# EAGLE design openSX70-dongle_v3-9 (EAGLE 9.2.2)
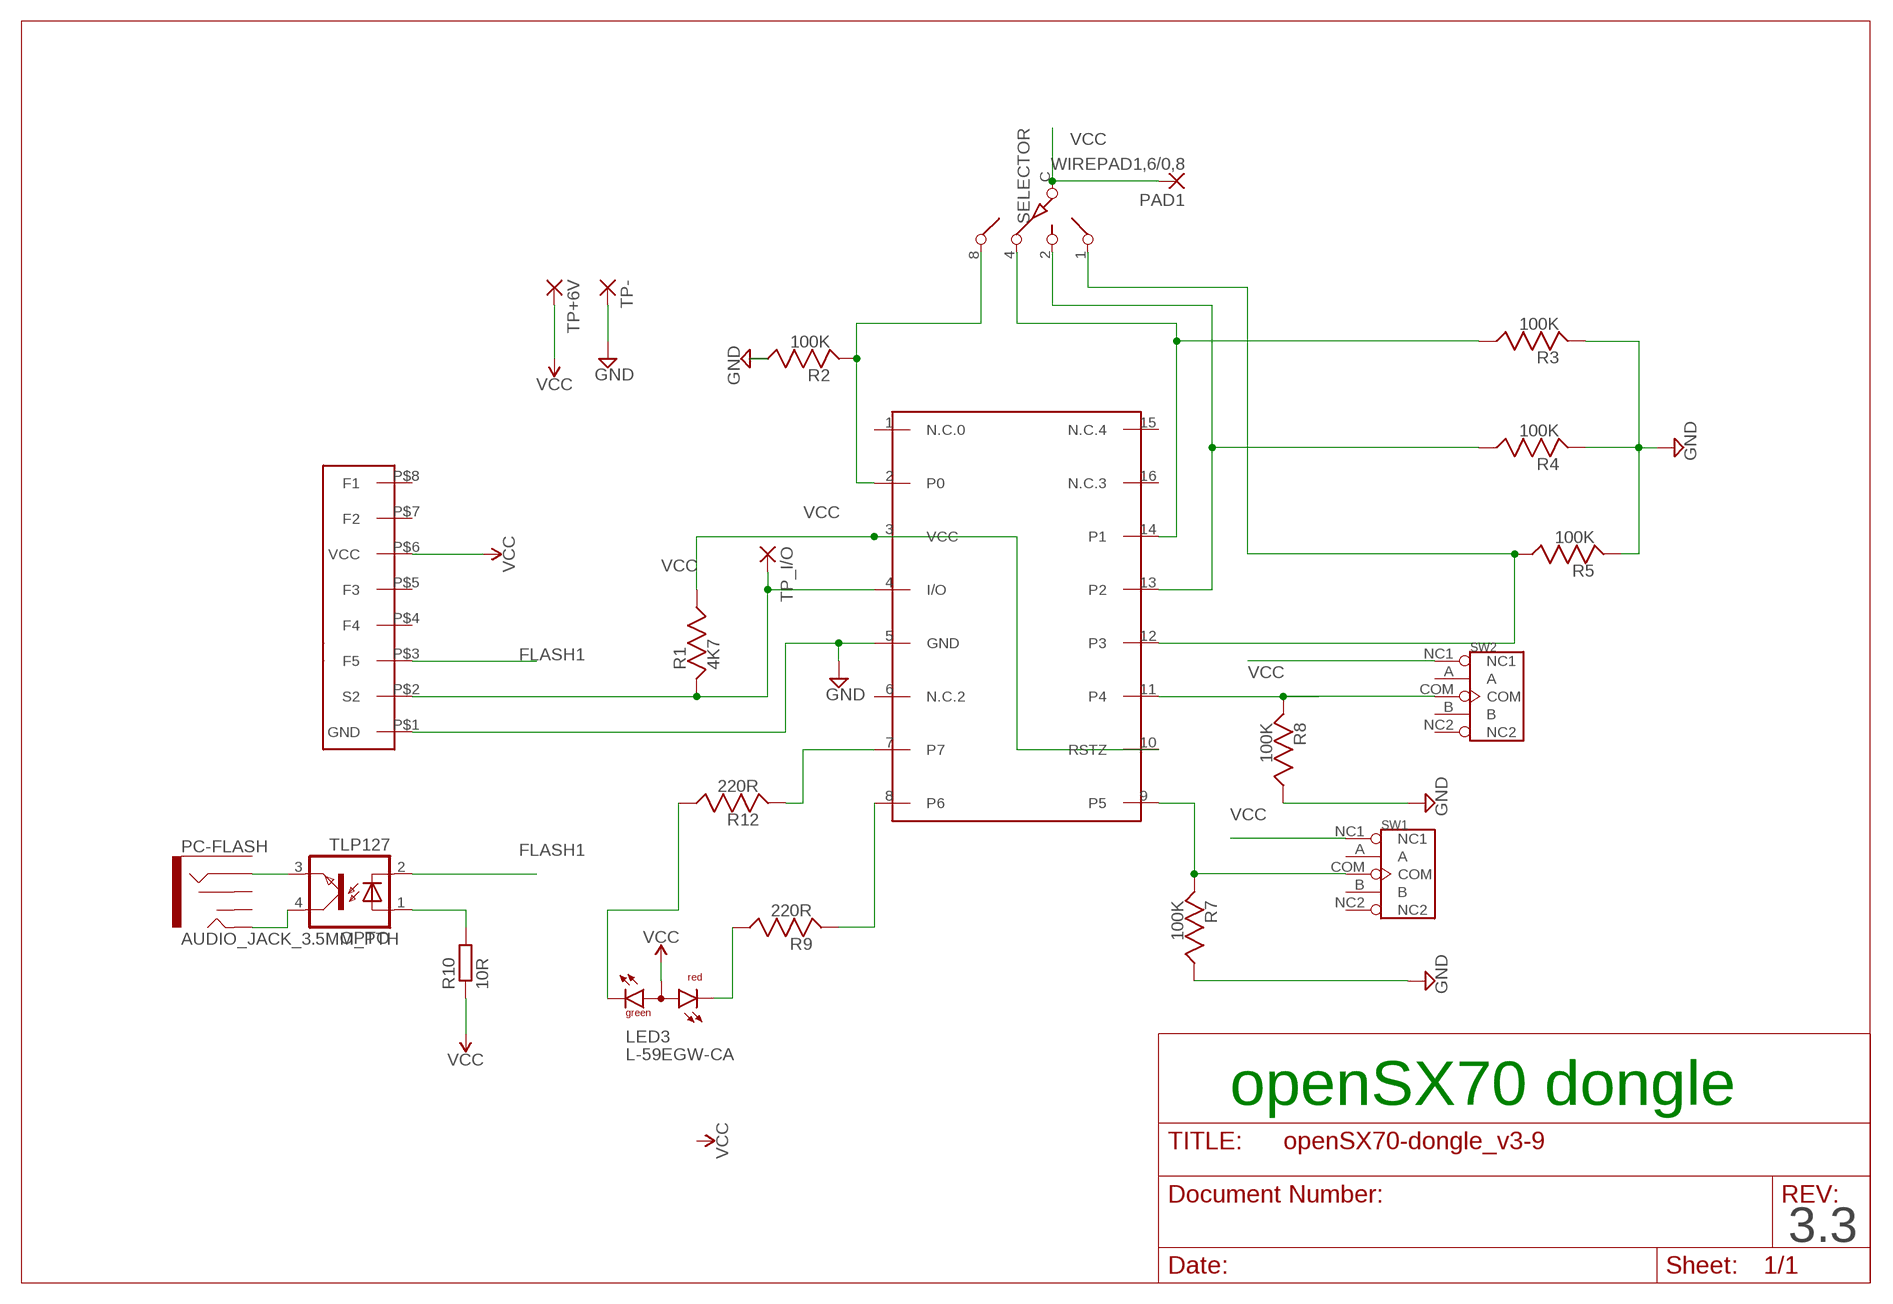
[diagram p0: schematic, sheet 1]

## Parts
DS2408  DS2408  [SO16]
LED3  L-59EGW-CA  [L-59EGW-CA]
OPTO  TLP127  [SO-4]
PAD1  WIREPAD1,6/0,8  [1,6/0,8]
PC-FLASH  AUDIO_JACK_3.5MM_PTH  [AUDIO-JACK]
R1  4K7  CRCW06034K70FKEA  [CRCW06034K70FKEA_RESC1608X55]
R2  100K  ERJ-3EKF1003V  [ERJ-3EKF1003V_RESC1608X55]
R3  100K  ERJ-3EKF1003V  [ERJ-3EKF1003V_RESC1608X55]
R4  100K  ERJ-3EKF1003V  [ERJ-3EKF1003V_RESC1608X55]
R5  100K  ERJ-3EKF1003V  [ERJ-3EKF1003V_RESC1608X55]
R7  100K  ERJ-3EKF1003V  [ERJ-3EKF1003V_RESC1608X55]
R8  100K  ERJ-3EKF1003V  [ERJ-3EKF1003V_RESC1608X55]
R9  220R  RC0603FR-07220RL  [RC0603FR-07220RL_RESC1608X55]
R10  10R  R-EU_R0603  [R0603]
R12  220R  RC0603FR-07220RL  [RC0603FR-07220RL_RESC1608X55]
SELECTOR  SW-C16  [SW-C16]
SW1  DIP-TOGGLE-SWITCH-ON-ON(3+2P-8.8X4.6MM)-90D  [SW5-2.0-8.8X4.4X4.7MM-90D]
SW2  DIP-TOGGLE-SWITCH-ON-ON(3+2P-8.8X4.6MM)-90D  [SW5-2.0-8.8X4.4X4.7MM-90D]
TP+6V  SMD2  [SMD1,27-2,54]
TP-  SMD2  [SMD1,27-2,54]
TP_I/O  SMD2  [SMD1,27-2,54]
U$1  FLASH-EDGE-CONNECTOR  [FLASH-EDGE-8]

## Nets
FLASH1: OPTO.2(C) U$1.P$3(F5)
GND: DS2408.5(GND) R2.2 R3.1 R4.1 R5.1 R7.2 R8.2 TP-.1(P) U$1.P$1(GND)
N$1: DS2408.4(I/O) R1.1 TP_I/O.1(P) U$1.P$2(S2)
N$2: LED3.1(CR) R9.2
N$3: DS2408.2(P0) R2.1 SELECTOR.8
N$4: DS2408.14(P1) R3.2 SELECTOR.4
N$5: DS2408.13(P2) R4.2 SELECTOR.2
N$6: DS2408.11(P4) R8.1 SW2.COM
N$7: DS2408.9(P5) R7.1 SW1.COM
N$8: DS2408.8(P6) R9.1
N$9: OPTO.1(A) R10.2
N$10: LED3.3(CG) R12.2
N$11: DS2408.7 R12.1
N$12: OPTO.4(COL) PC-FLASH.TIP
N$13: DS2408.12(P3) R5.2 SELECTOR.1
N$15: OPTO.3(EMIT) PC-FLASH.RING
VCC: DS2408.3(VCC) DS2408.10(RSTZ) LED3.2(A) PAD1.1(P) R1.2 R10.1 SELECTOR.C SW1.NC1 SW2.NC1 TP+6V.1(P) U$1.P$6(VCC)
Unconnected: DS2408.1(N.C.0) DS2408.6(N.C.2) DS2408.15(N.C.4) DS2408.16(N.C.3) PC-FLASH.RSH PC-FLASH.SLEEVE PC-FLASH.TSH SW1.A SW1.B SW1.NC2 SW2.A SW2.B SW2.NC2 U$1.P$4(F4) U$1.P$5(F3) U$1.P$7(F2) U$1.P$8(F1)

## Notes on the sheet
- openSX70 dongle
- 3.3

## Library data of the parts
DS2408 = DS2408-joaco:DS2408
LED3 = led:L-59EGW-CA: T-1 3/4 (5mm) BI-COLOR INDICATOR LAMP Source: http://www.kingbright.com/manager/upload/pdf/L-59EGW-CA%28Ver1292805989.13%29
OPTO = openSX70:TLP127
PAD1 = wirepad:WIREPAD: Wire PAD connect wire on PCB
PC-FLASH = SparkFun-Connectors:AUDIO_JACK_3.5MM: Audio Jack 3.5mm variants of PTH and SMT stereo audio jack with bypass switches. SparkFun Products: SparkFun SparkPunk Sound Kit <[https://www.sparkfun.com/products/11177]> - PTH MP3 Trigger <https://www.sparkfun.com/products/13720> -3.5mm SMD SparkFun PicoBoard <https://www.sparkfun.com/products/11888>- 2.5mm SMD; PROD_ID: CONN-08774; SF_ID: PRT-08032
R1 = Common-Parts-Library-Eagle:CRCW06034K70FKEA: Res Thick Film 0603 4.7K Ohm 1% 0.1W(1/10W) ±100ppm/C Molded SMD Automotive Paper T/R; MANUFACTURER: VISHAY
R2-R5 R7 R8 = Common-Parts-Library-Eagle:ERJ-3EKF1003V: Res Thick Film 0603 100K Ohm 1% 0.1W(1/10W) Â±100ppm/Â°C Molded SMD Automotive Punched T/R; MANUFACTURER: PANASONIC
R9 R12 = Common-Parts-Library-Eagle:RC0603FR-07220RL: Surface Mount Thick Film Resistor, RC Series, 220 ohm, 100 mW, - 1%, 50 V, 0603 [1608 Metric]; MANUFACTURER: YAGEO
R10 = resistor:R-EU_: RESISTOR, European symbol
SELECTOR = special:SW-C16: SWITCH 16-step rotary switch
SW1 SW2 = Seeed-Switch:DIP-TOGGLE-SWITCH-ON-ON(3+2P-8.8X4.6MM)-90D: 311030008; MPN: 3P-2.0-90D3P-2.0-90D-REINFORCE
TP+6V TP- TP_I/O = wirepad:SMD2: SMD PAD
U$1 = SX70-flash:FLASH-EDGE-CONNECTOR

## Net classes
0 GND: width 0.305 mm
1 VCC: width 0.254 mm
2 2.8V: width 0.254 mm

## Board
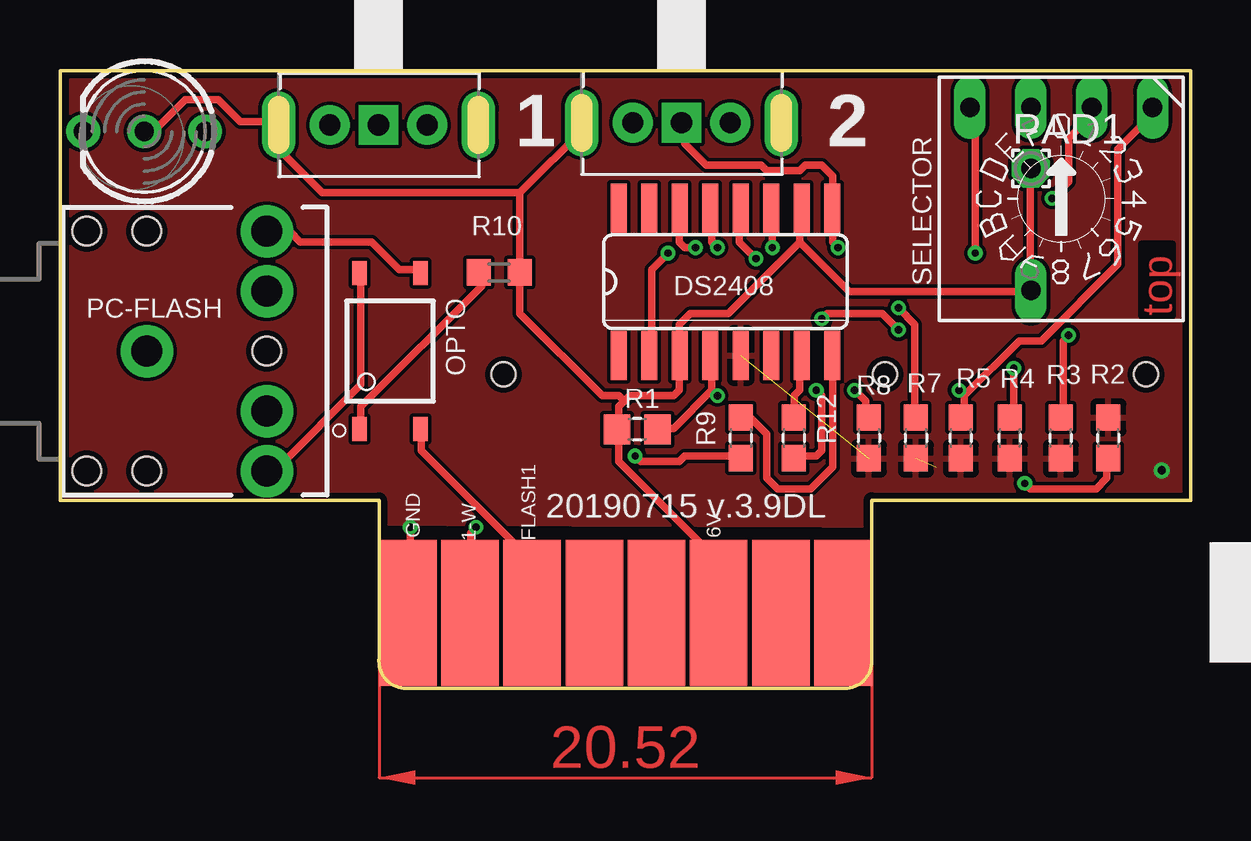
[diagram p1: board, top side]
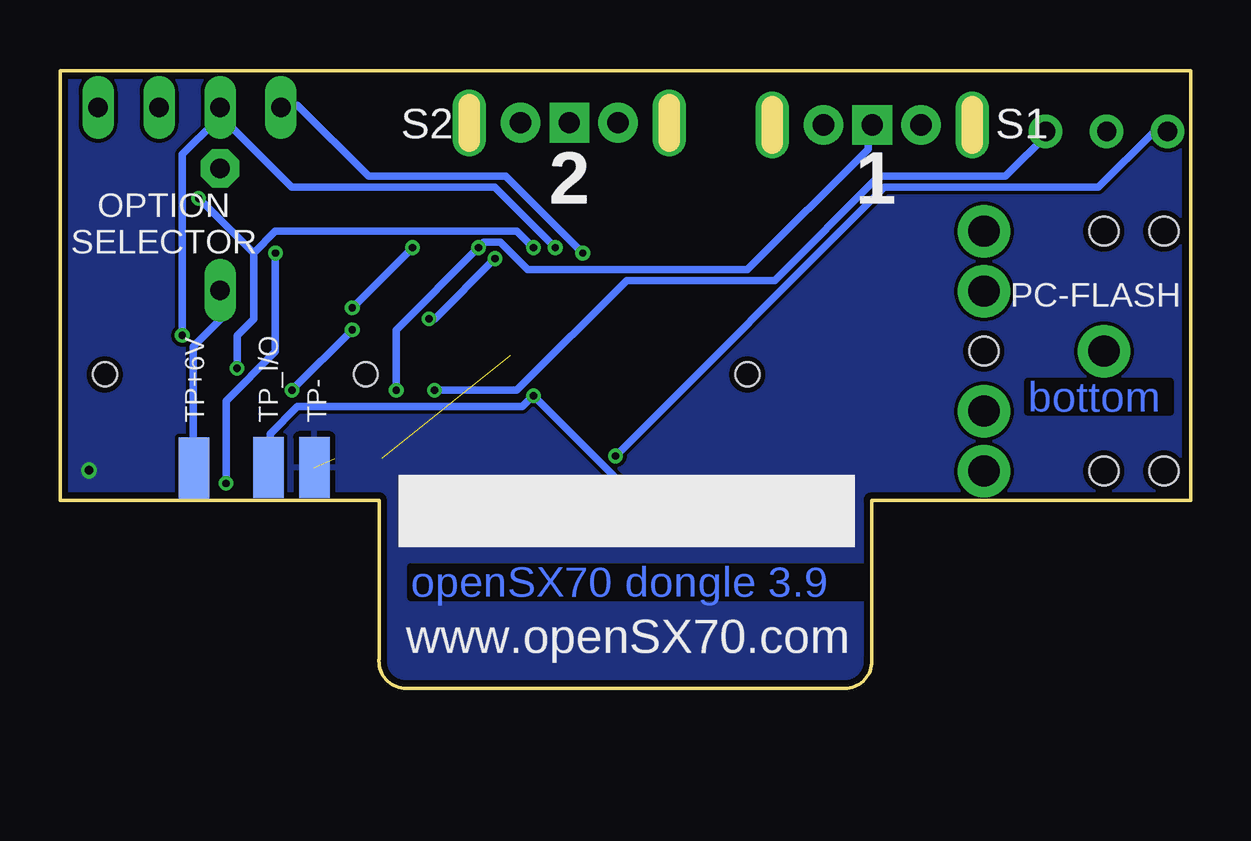
[diagram p2: board, bottom side, seen from below]

Size 47.12 x 25.74 mm. Coordinates in mm from the lower left corner, seen from the top.
Outline: 33.84,7.71 33.82,7.83
Outline: 33.82,7.83 33.82,1.24 arc-90 32.8,0 14.31,0 arc-90 13.3,1.24 13.3,7.83 0,7.83 0,25.74 47.12,25.74 47.12,7.83 33.82,7.83
Copper layers (1*16): Top 0.035mm / dielectric 1.5mm / Bottom 0.035mm
Design rules "SeeedStudio_2layer_DRU_no_angle_20140221": minimum track width 6mil, minimum drill 12mil, track to track 6mil, track to pad 6mil, pad to pad 6mil, via to via 6mil, smd to smd 0mil, copper to edge 10mil, drill to drill 10mil, minimum pad ring 10mil, minimum via ring 6mil, stop-mask expansion 2mil, vias tented up to drill 100mil, thermal gap 10mil
Holes 1 mm at 18.48,13.09 34.38,13.09 45.25,13.09

### Footprints (pad centres in the part's own frame; a part is rotated, then mirrored left to right if it is on the bottom)
SO16 = smd 0.66 x 2.032: 1 -4.445,-3.073; 2 -3.175,-3.073; 3 -1.905,-3.073; 4 -0.635,-3.073; 5 0.635,-3.073; 6 1.905,-3.073; 7 3.175,-3.073; 8 4.445,-3.073; 9 4.445,3.073; 10 3.175,3.073; 11 1.905,3.073; 12 0.635,3.073; 13 -0.635,3.073; 14 -1.905,3.073; 15 -3.175,3.073; 16 -4.445,3.073
L-59EGW-CA = drill 0.8 pad 1.4: 1 0,2.54; 2 0,0; 3 0,-2.54
SO-4 = smd 1 x 0.6: 1 -3.24,0.635; 2 -3.24,-1.905; 3 3.24,-1.905; 4 3.24,0.635
1,6/0,8 = drill 0.813 pad 1.6 octagon: 1 0,0
AUDIO-JACK = drill 1.3 pad 2.184: RING 5,5; RSH 5,2.5; SLEEVE 0,0; TIP 5,-5; TSH 5,-2.5 | hole 1.2: 0,5; -2.5,5; -2.5,-5; 0,-5; 5,0
CRCW06034K70FKEA_RESC1608X55 = smd 1.1 x 1.25: 1 -0.85,0; 2 0.85,0
ERJ-3EKF1003V_RESC1608X55 = smd 1.1 x 1: 1 -0.85,0; 2 0.85,0
RC0603FR-07220RL_RESC1608X55 = smd 1.1 x 1: 1 -0.85,0; 2 0.85,0
R0603 = smd 1 x 1.1: 1 -0.85,0; 2 0.85,0
SW-C16 = drill 0.813 long: 1 -3.81,-3.81; 2 -1.27,-3.81; 4 1.27,-3.81; 8 3.81,-3.81; C 1.27,3.81
SW5-2.0-8.8X4.4X4.7MM-90D = drill 0.889 pad 1.651: A 0,2.032; B 0,-2.032 | drill 0.889 pad 1.651 square: COM 0,0 | drill 0.762 pad 1.397 long: NC1 0,4.166; NC2 0,-4.166
SMD1,27-2,54 = smd 1.27 x 2.54: 1 0,0
FLASH-EDGE-8 = smd 2.4 x 6.09: P$1 -9.065,0; P$2 -6.475,0; P$3 -3.885,0; P$4 -1.295,0; P$5 1.295,0; P$6 3.885,0; P$7 6.475,0; P$8 9.065,0

### Placement (x,y rotation side)
DS2408  27.73,16.95 0 top
LED3  3.51,23.22 90 top
OPTO  13.12,14.06 90 top
PAD1  40.45,21.68 0 top
PC-FLASH  3.62,14.06 0 top
R1  24.05,10.8 180 top
R2  43.68,10.44 90 top
R3  41.7,10.44 90 top
R4  39.58,10.44 90 top
R5  37.54,10.44 90 top
R7  35.67,10.44 270 top
R8  33.7,10.44 270 top
R9  28.36,10.44 270 top
R10  18.3,17.33 180 top
R12  30.57,10.44 270 top
SELECTOR  41.72,20.41 180 top
SW1  25.9,23.58 90 top
SW2  13.27,23.49 90 top
TP+6V  41.53,9.19 180 bottom
TP-  36.52,9.2 0 bottom
TP_I/O  38.43,9.21 0 bottom
U$1  23.56,3.15 0 top

### Tracks (layer width: path | path; a pad name or v marks a point on that pad's centre or on a via)
FLASH1
  Top 0.305: OPTO.2 15.05,10.6 15.05,9.92 19.62,5.34 19.62,3.29 U$1.P$3
GND  (via drill 0.3, 0.35)  (2 unrouted)
  Top 0.305: 14.59,6.94 v14.59,6.71 14.59,3.29 U$1.P$1
  other vias: 45.9,9.09
  pour Top: 0.44,25.49 47.43,25.49 47.43,6.71 0.44,6.89
  pour Bottom: 0.44,25.49 0.44,6.71 13.14,6.71 13.14,0.36 33.46,0.36 33.46,6.71 47.43,6.71 47.43,25.49
N$1  (via drill 0.3)
  Top 0.305: 27.17,12.43 25.57,10.83 25.11,10.83 R1.1 | 27.17,12.43 27.17,13.8 DS2408.4 | 27.17,12.43 v27.39,12.2 | v17.34,6.71 17.11,6.49 17.11,3.29 U$1.P$2
  Bottom 0.305: TP_I/O.1 38.37,9.23 38.37,10.6 37.22,11.74 27.85,11.74 v27.39,12.2 21.91,6.71 v17.34,6.71
N$2  (via drill 0.3)
  Top 0.305: v23.96,9.69 24.19,9.46 25.79,9.46 26.02,9.69 28.31,9.69 R9.2
  Bottom 0.305: v23.96,9.69 12.76,20.89 3.85,20.89 1.56,23.17 1.1,23.17 LED3.1
N$3  (via drill 0.3)
  Top 0.305: v40.2,8.54 40.42,8.32 43.17,8.32 43.62,8.77 43.62,9.46 R2.1 | v38.14,18.14 38.14,23.86 37.91,24.09 SELECTOR.8 | v25.34,18.14 24.65,17.46 24.65,14.03 DS2408.2
  Bottom 0.305: v40.2,8.54 40.2,11.97 38.14,14.03 v38.14,18.14 | v25.34,18.14 28.54,21.35 34.25,21.35 37.22,24.32 37.91,24.32 SELECTOR.8
N$4  (via drill 0.3)
  Top 0.305: v42.02,14.72 41.8,14.49 41.8,11.52 R3.2 | v26.48,18.37 26.02,18.37 25.79,18.6 25.79,19.97 DS2408.14
  Bottom 0.305: v42.02,14.72 42.02,22.26 40.65,23.63 40.65,24.09 | v26.48,18.37 28.99,20.89 37.45,20.89 40.65,24.09 | 40.65,24.09 SELECTOR.4
N$5  (via drill 0.3)
  Top 0.305: v39.74,13.34 39.74,11.52 R4.2 | v41.34,20.43 42.02,21.12 42.02,22.95 43.17,24.09 SELECTOR.2 | v27.39,18.37 27.17,18.6 27.17,19.97 DS2408.13
  Bottom 0.305: v39.74,13.34 39.74,14.72 39.05,15.4 39.05,18.14 | v41.34,20.43 39.05,18.14 | v27.39,18.37 28.08,19.06 38.14,19.06 39.05,18.14
N$6  (via drill 0.3)
  Top 0.305: v33.11,12.43 33.57,11.97 33.57,11.52 R8.1 | v29.68,18.37 29.68,19.97 DS2408.11
  Bottom 0.305: v33.11,12.43 33.11,14.94 v29.68,18.37 29.45,18.6 28.77,18.6 27.62,17.46 18.48,17.46 13.45,22.49 13.45,23.4 SW2.COM
N$7  (via drill 0.3)
  Top 0.305: v34.94,15.86 35.62,15.17 35.62,11.52 R7.1 | v32.42,18.37 32.19,18.6 32.19,19.97 DS2408.9 32.19,20.2 32.19,21.35 31.74,21.8 31.05,21.8 30.82,21.57 29.45,21.57 29.22,21.8 26.94,21.8 26.02,22.72 26.02,23.4 SW1.COM
  Bottom 0.305: v32.42,18.37 v34.94,15.86
N$8
  Top 0.305: R9.1 28.54,11.29 28.77,11.29 29.45,10.6 29.45,8.77 29.91,8.32 31.28,8.32 32.19,9.23 32.19,13.8 DS2408.8
N$9
  Top 0.305: OPTO.1 12.53,10.83 12.53,11.74 17.56,16.77 17.56,17.23 R10.2
N$10  (via drill 0.3)
  Top 0.305: v31.51,12.43 31.74,12.2 31.74,9.92 31.51,9.69 30.59,9.69 R12.2
  Bottom 0.305: v31.51,12.43 28.08,12.43 23.51,17 17.34,17 12.99,21.35 7.73,21.35 5.91,23.17 LED3.3
N$11
  Top 0.305: R12.1 30.59,11.52 30.59,12.2 30.82,12.43 30.82,13.8 DS2408.7
N$12
  Top 0.305: OPTO.4 12.53,17.23 12.53,12.66 9.11,9.23 8.65,9.23 PC-FLASH.TIP
N$13  (via drill 0.3)
  Top 0.305: 37.68,12.2 37.68,11.52 R5.2 | 37.68,12.2 39.97,14.49 40.88,14.49 44.08,17.69 44.08,22.49 45.68,24.09 SELECTOR.1 | v28.99,17.92 28.31,18.6 28.31,19.97 DS2408.12 | v31.74,15.4 31.97,15.63 34.25,15.63 v34.94,14.94 | 37.68,12.2 v37.45,12.43
  Bottom 0.305: v28.99,17.92 31.51,15.4 v31.74,15.4 | v37.45,12.43 v34.94,14.94
N$15
  Top 0.305: OPTO.3 14.82,17.46 14.14,17.46 12.99,18.6 10.02,18.6 9.56,19.06 8.65,19.06 PC-FLASH.RING
VCC
  Top 0.305: LED3.2 3.62,23.4 4.08,23.4 5.22,24.55 6.59,24.55 7.51,23.63 9.11,23.63 SW2.NC1 9.11,22.49 10.93,20.66 19.16,20.66 | 19.16,20.66 19.16,17.46 R10.1 19.16,17.23 19.16,15.63 22.59,12.2 23.28,12.2 23.51,11.97 | 19.16,20.66 21.91,23.4 SW1.NC1 | PAD1.1 40.42,21.57 40.42,16.77 SELECTOR.C 40.42,16.54 32.88,16.54 30.82,18.6 | 23.51,11.97 23.74,12.2 25.57,12.2 25.79,12.43 25.79,13.8 DS2408.3 25.79,14.03 25.79,15.17 26.25,15.63 27.85,15.63 30.82,18.6 | 23.51,11.97 23.28,11.74 23.28,10.83 R1.2 23.28,10.6 23.28,9.46 27.39,5.34 27.39,3.29 U$1.P$6 | 30.82,18.6 30.82,19.97 DS2408.10
  Bottom 0.305: TP+6V.1 41.57,9.23 41.57,14.26 40.42,15.4 40.42,16.54 SELECTOR.C
(copper drawn outside any net)
  shapes: Top area x1

### Text on the board
Top: top
Bottom: bottom | openSX70 dongle 3.9
tPlace: 1 | 2 | 20190715 v.3.9DL
bPlace: 1 | 2 | www.openSX70.com
tNames: GND | 1-W | FLASH1 | 6V
bNames: S1 | S2 | OPTION / SELECTOR | PC-FLASH